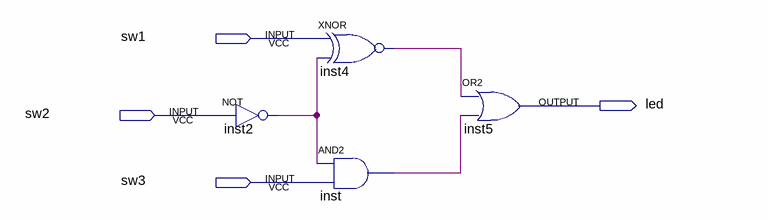
[diagram p0: schematic sheet]
// Quartus schematic Block1.bdf as structural Verilog: 4 symbols, 4 pins
module Block1 (
  input  sw1,
  input  sw2,
  input  sw3,
  output led
);

  wire inst2_out, inst4_out, inst_out;

  not inst2 (inst2_out, sw2);
  xnor inst4 (inst4_out, sw1, inst2_out);
  and inst (inst_out, inst2_out, sw3);
  or inst5 (led, inst4_out, inst_out);
endmodule
